# EAGLE design tec_controller_v2 (EAGLE 7.2.0)
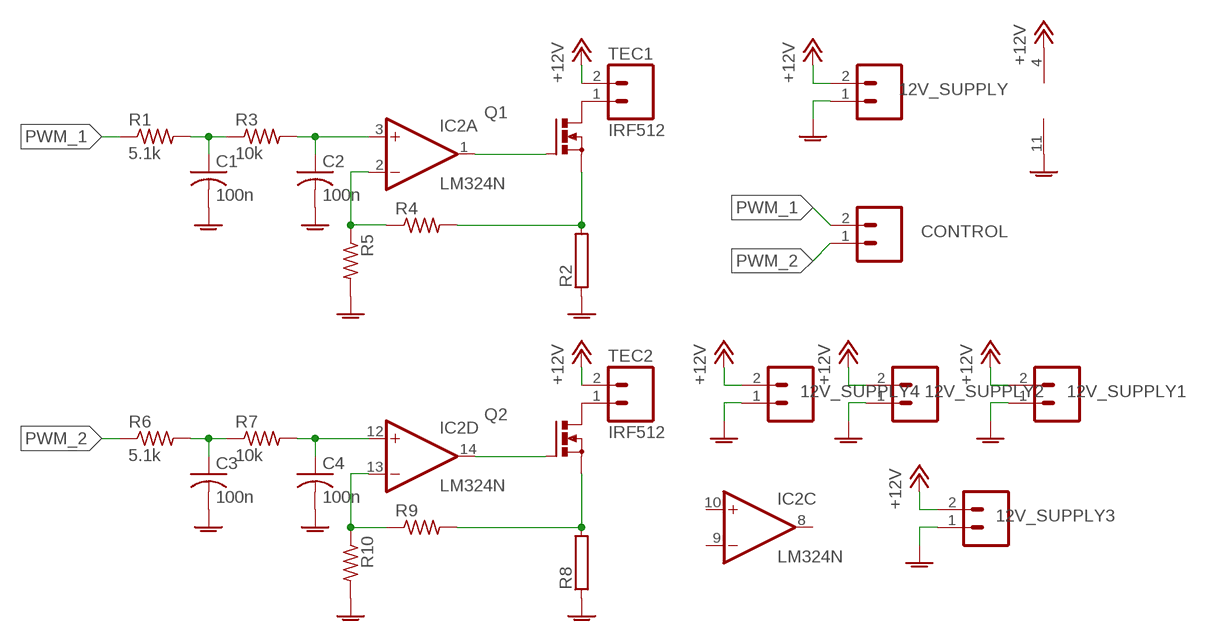
[diagram p0: schematic, sheet 1]

## Parts
12V_SUPPLY  M02LOCK_LONGPADS  [1X02_LOCK_LONGPADS]
12V_SUPPLY1  M02LOCK_LONGPADS  [1X02_LOCK_LONGPADS]
12V_SUPPLY2  M02LOCK_LONGPADS  [1X02_LOCK_LONGPADS]
12V_SUPPLY3  M02LOCK_LONGPADS  [1X02_LOCK_LONGPADS]
12V_SUPPLY4  M02LOCK_LONGPADS  [1X02_LOCK_LONGPADS]
C1  100n  C-USC0805  [C0805]
C2  100n  C-USC0805  [C0805]
C3  100n  C-USC0805  [C0805]
C4  100n  C-USC0805  [C0805]
CONTROL  M02LOCK_LONGPADS  [1X02_LOCK_LONGPADS]
IC2  LM324N  [DIL14]
Q1  IRF512  [TO220BV]
Q2  IRF512  [TO220BV]
R1  5.1k  R-US_M0805  [M0805]
R2  RAC10  [AC10]
R3  10k  R-US_M0805  [M0805]
R4  R-US_M0805  [M0805]
R5  R-US_M0805  [M0805]
R6  5.1k  R-US_M0805  [M0805]
R7  10k  R-US_M0805  [M0805]
R8  RAC10  [AC10]
R9  R-US_M0805  [M0805]
R10  R-US_M0805  [M0805]
TEC1  M02LOCK_LONGPADS  [1X02_LOCK_LONGPADS]
TEC2  M02LOCK_LONGPADS  [1X02_LOCK_LONGPADS]

## Nets
+12V: 12V_SUPPLY1.2 12V_SUPPLY2.2 12V_SUPPLY3.2 12V_SUPPLY4.2 12V_SUPPLY.2 IC2.4(P:V+) TEC1.2 TEC2.2
GNDA: 12V_SUPPLY1.1 12V_SUPPLY2.1 12V_SUPPLY3.1 12V_SUPPLY4.1 12V_SUPPLY.1 C1.2 C2.2 C3.2 C4.2 IC2.11(P:V-) R2.1 R5.2 R8.1 R10.2
N$1: Q1.D TEC1.1
N$2: Q1.S R2.2 R4.2
N$3: IC2.1(A:OUT) Q1.G
N$4: C1.1 R1.2 R3.1
N$5: C2.1 IC2.3(A:+IN) R3.2
N$6: IC2.2(A:-IN) R4.1 R5.1
N$7: C3.1 R6.2 R7.1
N$8: C4.1 IC2.12(D:+IN) R7.2
N$9: Q2.D TEC2.1
N$10: Q2.S R8.2 R9.2
N$11: IC2.14(D:OUT) Q2.G
N$12: IC2.13(D:-IN) R9.1 R10.1
PWM_1: CONTROL.2 R1.1
PWM_2: CONTROL.1 R6.1
Unconnected: IC2.5(B:+IN) IC2.6(B:-IN) IC2.7(B:OUT) IC2.8(C:OUT) IC2.9(C:-IN) IC2.10(C:+IN)

## Library data of the parts
12V_SUPPLY 12V_SUPPLY1-12V_SUPPLY4 CONTROL TEC1 TEC2 = SparkFun-Connectors:M02: Standard 2-pin 0.1" header. Use with - straight break away headers ( PRT-00116) - right angle break away headers (PRT-00553) - swiss pins (PRT-00743) - machine pins (PRT-00117) - female headers (PRT-00115) Molex polarized connector foot print use with: PRT-08233 with associated crimp pins and housings. 2.54_SCREWTERM for use with PRT-10571. 3.5mm Screw Terminal footprints for PRT-08084 5mm Screw Terminal footprints for use with PRT-08433
C1-C4 = rcl:C-US: CAPACITOR, American symbol
IC2 = linear:LM324: OP AMP
Q1 Q2 = transistor-power:IRF512: N-CHANNEL MOS FET
R1 R3-R7 R9 R10 = rcl:R-US_: RESISTOR, American symbol
R2 R8 = resistor-power:R: Power Resitor; OC_FARNELL: unknown; OC_NEWARK: unknown

## Board
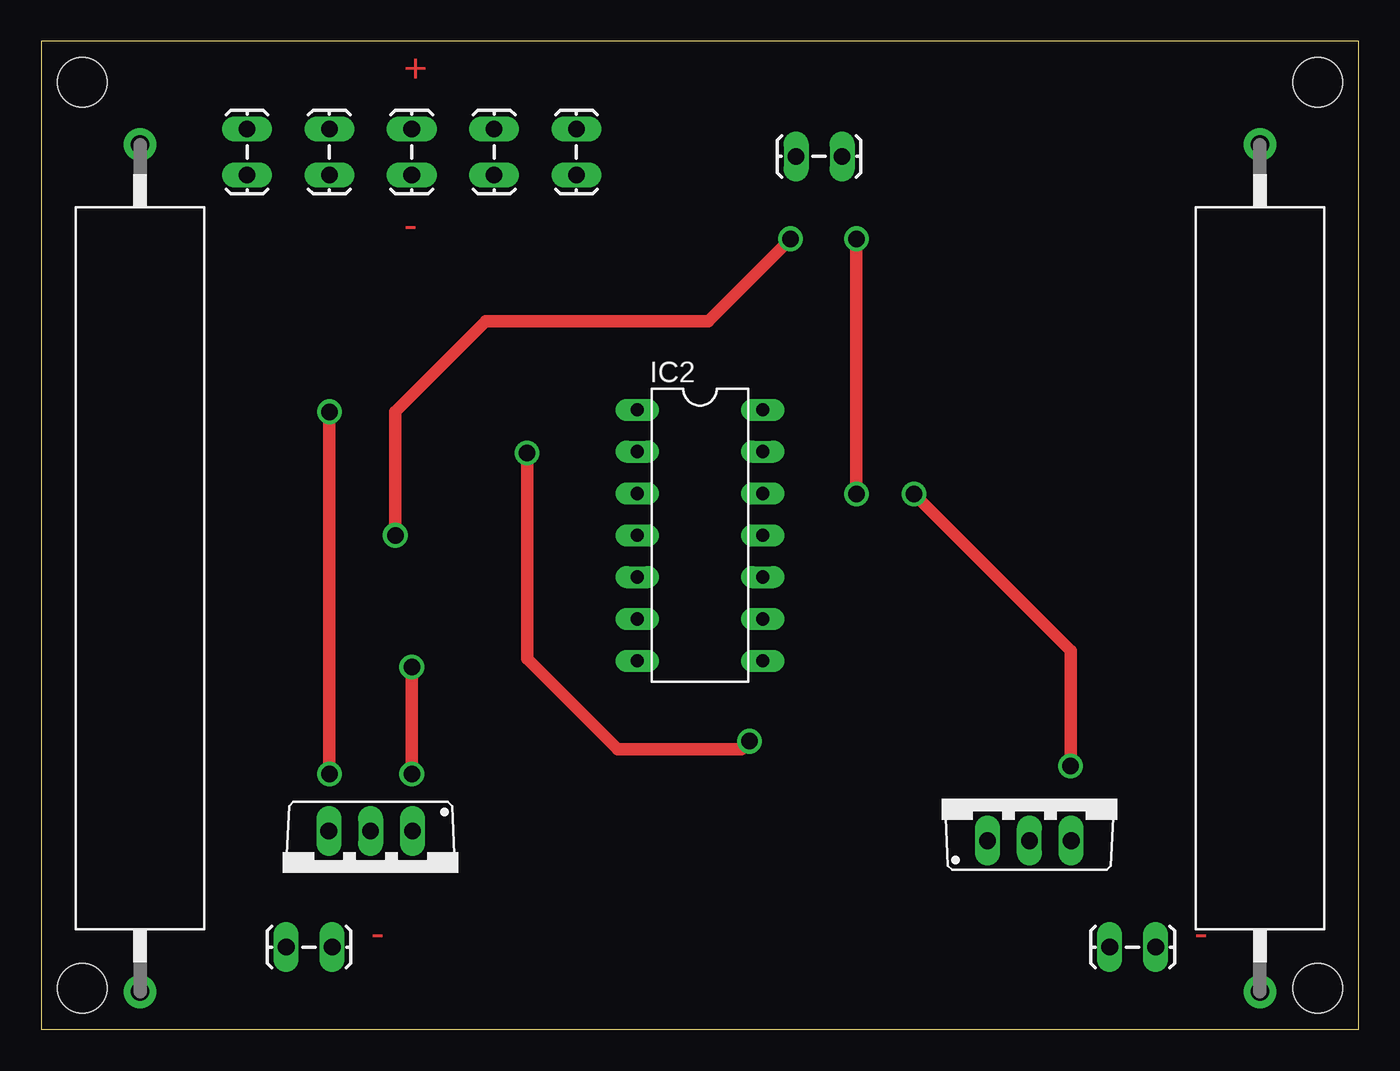
[diagram p1: board, top side]
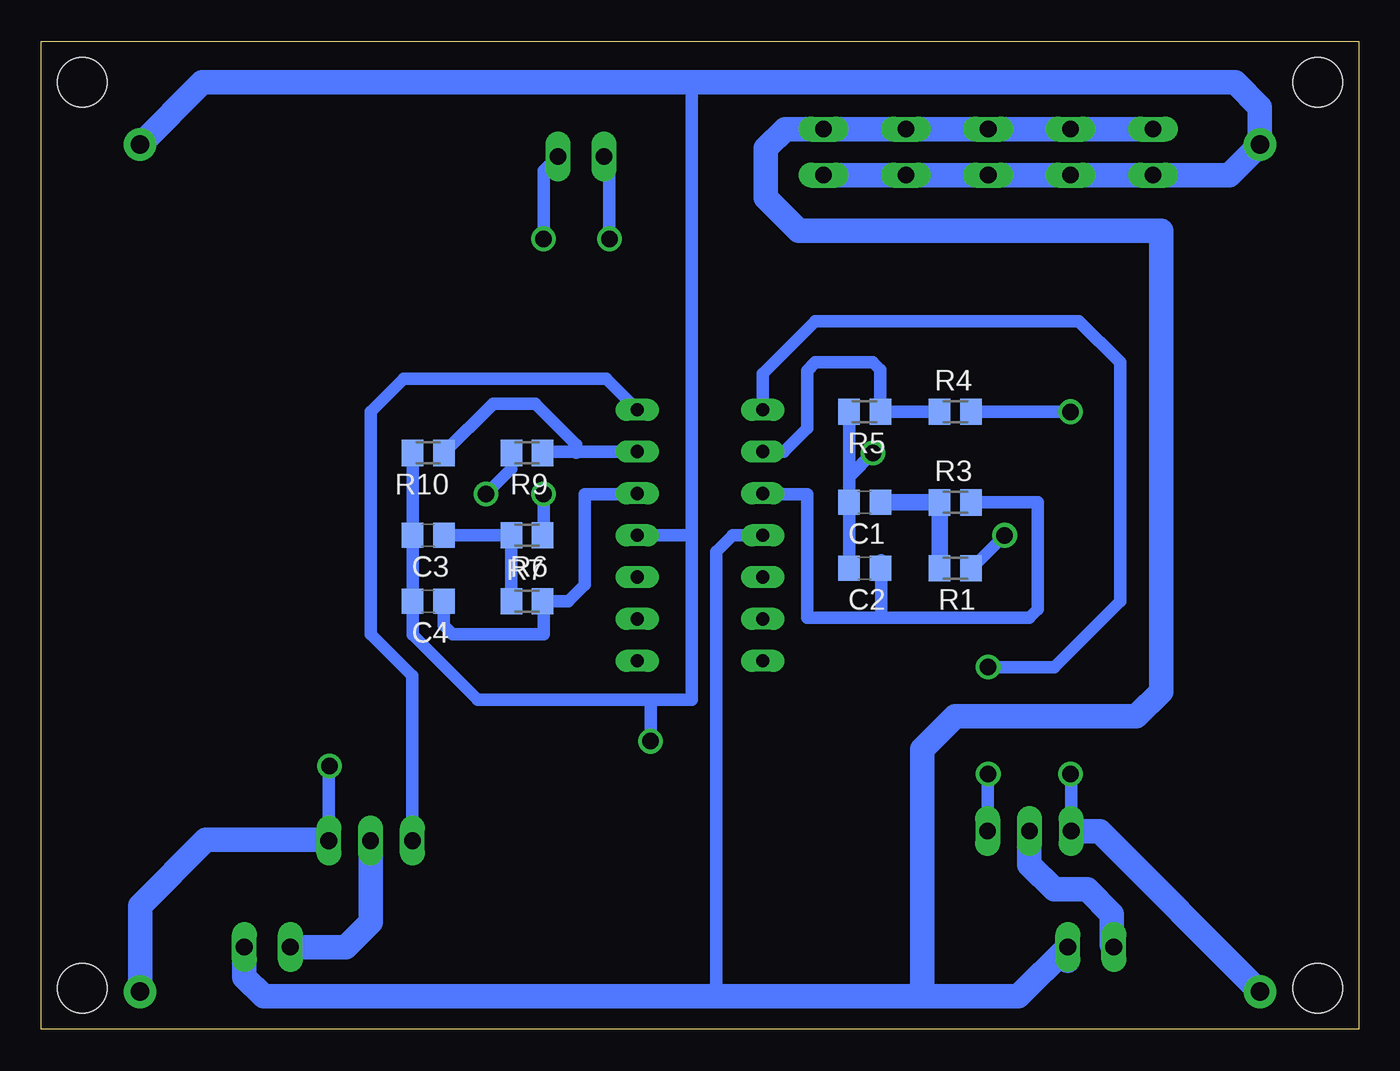
[diagram p2: board, bottom side, seen from below]

Size 80 x 60 mm. Coordinates in mm from the lower left corner, seen from the top.
Outline: 0,0 80,0 80,60 0,60 0,0
Copper layers (1*16): Top 0.035mm / dielectric 1.5mm / Bottom 0.035mm
Design rules "default *": minimum track width 10mil, minimum drill 24mil, track to track 20mil, track to pad 20mil, pad to pad 20mil, via to via 20mil, smd to smd 20mil, copper to edge 10mil, drill to drill 8mil, minimum pad ring 10mil, minimum via ring 8mil, stop-mask expansion 4mil, vias tented up to drill 0mil, thermal gap 10mil
Holes 3 mm at 2.5,57.5 77.5,57.5 77.5,2.5 2.5,2.5

### Footprints (pad centres in the part's own frame; a part is rotated, then mirrored left to right if it is on the bottom)
1X02_LOCK_LONGPADS = drill 1.016 long: 1 -0.127,0; 2 2.667,0
C0805 = smd 1.3 x 1.5: 1 -0.95,0; 2 0.95,0
DIL14 = drill 0.813 long: 1 -7.62,-3.81; 2 -5.08,-3.81; 3 -2.54,-3.81; 4 0,-3.81; 5 2.54,-3.81; 6 5.08,-3.81; 7 7.62,-3.81; 8 7.62,3.81; 9 5.08,3.81; 10 2.54,3.81; 11 0,3.81; 12 -2.54,3.81; 13 -5.08,3.81; 14 -7.62,3.81
TO220BV = drill 1.016 long: D 0,-2.54; G -2.54,-2.54; S 2.54,-2.54
M0805 = smd 1.3 x 1.6: 1 -0.95,0; 2 0.95,0
AC10 = drill 1.1 pad 2: 1 -25.725,0; 2 25.7,0

### Placement (x,y rotation side)
12V_SUPPLY  12.5,52 90 top
12V_SUPPLY1  17.5,52 90 top
12V_SUPPLY2  22.5,52 90 top
12V_SUPPLY3  27.5,52 90 top
12V_SUPPLY4  32.5,52 90 top
C1  30,32 180 bottom
C2  30,28 180 bottom
C3  56.5,30 180 bottom
C4  56.5,26 180 bottom
CONTROL  48.5,53 180 top
IC2  40,30 270 top
Q1  20,9.5 180 top
Q2  60,14 0 top
R1  24.5,28 180 bottom
R2  6,28 270 top
R3  24.5,32 0 bottom
R4  24.5,37.5 0 bottom
R5  30,37.5 180 bottom
R6  50.5,30 180 bottom
R7  50.5,26 0 bottom
R8  74,28 270 top
R9  50.5,35 180 bottom
R10  56.5,35 180 bottom
TEC1  15,5 0 top
TEC2  65,5 0 top

### Tracks (layer width: path | path; a pad name or v marks a point on that pad's centre or on a via)
+12V
  Bottom 0.75: IC2.4 38,30 39,29 39,2
  Bottom 1.5: 12V_SUPPLY.2 12V_SUPPLY1.2 12V_SUPPLY2.2 12V_SUPPLY3.2 12V_SUPPLY4.2 34.83,54.67 36,53.5 36,50.5 34,48.5 12,48.5 12,20.5 13.5,19 24.5,19 26.5,17 26.5,2 | 26.5,2 20.67,2 TEC1.2 17.67,4.17 | 26.5,2 39,2 66.5,2 67.67,3.17 TEC2.2
GNDA  (via drill 1 pad 0.5)
  Top 0.75: v29.5,35 29.5,22.5 35,17 42.5,17 v43,17.5
  Bottom 0.75: C2.2 C1.2 | R10.2 C3.2 C4.2 57.45,23.95 53.5,20 43,20 | 40.5,30 40.5,57.5 | C1.2 R5.2 | IC2.11 40.5,30 | 40.5,30 40.5,20 43,20 | C1.2 30.95,33.55 v29.5,35 | v43,17.5 43,20
  Bottom 1.5: 12V_SUPPLY4.1 12V_SUPPLY3.1 12V_SUPPLY2.1 12V_SUPPLY1.1 12V_SUPPLY.1 7.85,51.87 R2.1 6,56 7.5,57.5 40.5,57.5 70.22,57.5 R8.1
N$1
  Bottom 1.5: TEC1.1 15,5.13 15,7 16.5,8.5 18.5,8.5 20,10 Q1.D
N$2  (via drill 1 pad 0.75)
  Top 0.75: v17.5,15.5 v17.5,37.5
  Bottom 0.75: Q1.S 17.46,15.46 v17.5,15.5 | v17.5,37.5 R4.2
  Bottom 1.5: R2.2 15.74,12.04 Q1.S
N$3  (via drill 1 pad 0.75)
  Top 0.75: v22.5,15.5 v22.5,22
  Bottom 0.75: IC2.1 36.19,39.81 33,43 17,43 14.5,40.5 14.5,26 18.5,22 v22.5,22 | Q1.G 22.54,15.46 v22.5,15.5
N$4
  Bottom 1: C1.1 R3.1 R1.2
N$5
  Bottom 0.75: 29,28.5 29,28.05 29,25 | 29,25 20,25 19.5,25.5 19.5,32 R3.2 | IC2.3 36.15,32.5 33.5,32.5 33.5,25 29,25
  Bottom 1: C2.1 29,28.05
N$6
  Bottom 0.75: R4.1 R5.1 29.05,40.05 29.5,40.5 33,40.5 33.5,40 33.5,36.5 34.92,35.08 IC2.2
N$7
  Bottom 0.75: R7.1 R6.2 C3.1
N$8
  Bottom 0.75: C4.1 55.55,24.55 55,24 49.5,24 49.5,25.95 R7.2 48,26 47,27 47,32.5 43.85,32.5 IC2.12
N$9
  Bottom 1.5: Q2.D 60,6.5 61.5,5 TEC2.1
N$10  (via drill 1 pad 0.75)
  Top 0.75: v53,32.5 62.5,23 v62.5,16
  Bottom 0.75: R9.2 51.45,34.05 v53,32.5 | v62.5,16 62.54,15.96 Q2.S
  Bottom 1.5: Q2.S 62.58,11.5 70,11.5 74,7.5 R8.2
N$11
  Bottom 0.75: Q2.G 57.46,21.46 60,24 60,37.5 58,39.5 45.69,39.5 IC2.14
N$12
  Bottom 0.75: R10.1 52.55,38 50,38 47.5,35.5 47.5,35 47.42,35.08 | 47.42,35.08 47,35.08 IC2.13 | R9.1 49.47,35.08 47.42,35.08
PWM_1  (via drill 1 pad 0.5)
  Top 0.75: v45.5,48 40.5,43 27,43 21.5,37.5 v21.5,30
  Bottom 0.75: v21.5,30 23.5,28 R1.1 | v45.5,48 45.5,52.67 CONTROL.2
PWM_2  (via drill 1 pad 0.5)
  Top 0.75: v49.5,32.5 v49.5,48
  Bottom 0.75: R6.1 49.5,30.05 v49.5,32.5 | v49.5,48 49.5,52.13 CONTROL.1

### Text on the board
Top: + | - | - | -